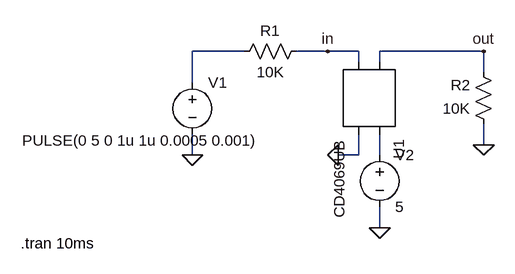
[diagram p0: schematic simulacionCD4069UB.asc]
simulacionCD4069UB.asc, the LTspice schematic file:
Version 4
SHEET 1 880 680
WIRE 16 96 -64 96
WIRE 144 96 96 96
WIRE 192 96 144 96
WIRE 384 96 224 96
WIRE 192 112 192 96
WIRE 224 112 224 96
WIRE 384 128 384 96
WIRE -64 144 -64 96
WIRE 384 240 384 208
WIRE -64 256 -64 224
WIRE 192 256 192 224
WIRE 192 256 160 256
WIRE 224 256 224 224
WIRE 224 368 224 336
FLAG -64 256 0
FLAG 224 368 0
FLAG 160 256 0
FLAG 384 240 0
FLAG 384 96 out
FLAG 144 96 in
SYMBOL AutoGenerated\\CD4069UB 208 160 R90
SYMATTR InstName U1
SYMBOL res 112 80 R90
WINDOW 0 0 56 VBottom 2
WINDOW 3 32 56 VTop 2
SYMATTR InstName R1
SYMATTR Value 10K
SYMBOL res 400 224 R180
WINDOW 0 36 76 Left 2
WINDOW 3 36 40 Left 2
SYMATTR InstName R2
SYMATTR Value 10K
SYMBOL voltage -64 128 R0
WINDOW 3 -262 105 Left 2
WINDOW 123 0 0 Left 0
WINDOW 39 0 0 Left 0
SYMATTR InstName V1
SYMATTR Value PULSE(0 5 0 1u 1u 0.0005 0.001)
SYMBOL voltage 224 240 R0
WINDOW 123 0 0 Left 0
WINDOW 39 0 0 Left 0
SYMATTR InstName V2
SYMATTR Value 5
TEXT -328 392 Left 2 !.tran 10ms

The netlist it stands for:
* simulacionCD4069UB.asc
* U1: CD4069UB (symbol AutoGenerated\CD4069UB not available, pins judged from their places): pin1=out pin2=in pin3=N002 pin4=0
R1 in N001 10K
R2 0 out 10K
V1 N001 0 PULSE(0 5 0 1u 1u 0.0005 0.001)
V2 N002 0 5
.tran 10ms
.backanno
.end